# EAGLE design PowerBoard (EAGLE 9.2.2)
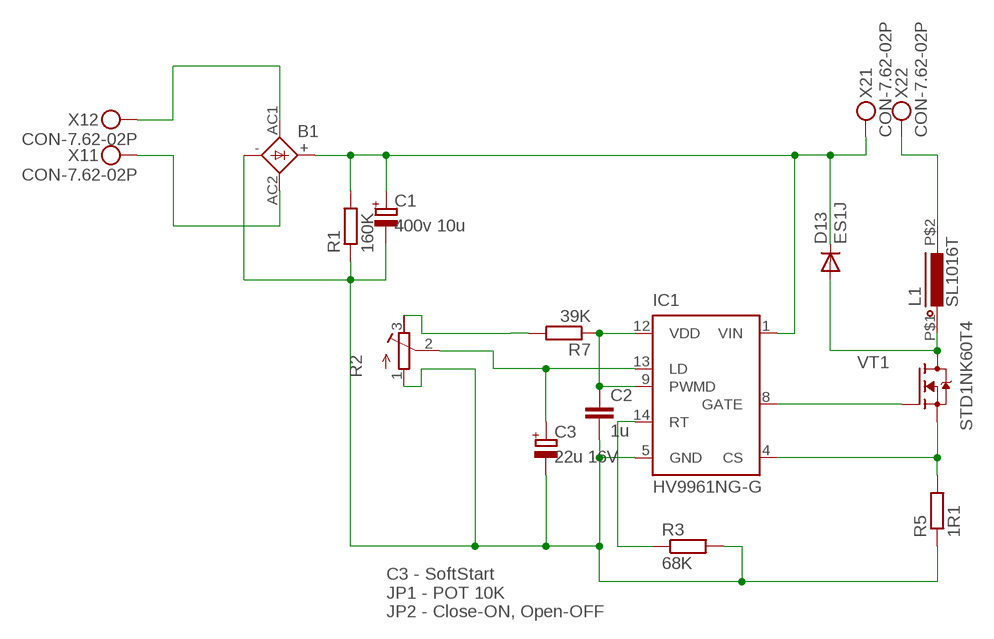
[diagram p0: schematic, sheet 1]

## Parts
B1  BRIDGEDBS  [DBS]
C1  400v 10u  CAP-POL_E3.5-8  [E3,5-8]
C2  1u  CAP_0805  [CAP0805]
C3  22u 16V  CAP-POL_3528  [CT3528]
D13  ES1J  DIODE_ES1J  [DO214AC]
IC1  HV9961NG-G  HV9910BNG  [SOIC-16NG]
L1  SL1016T  INDUCTORSL1016  [SL1016]
R1  160K  R_MF-0125  [MF-0125]
R2  R_POT3296X  [POT-3296X]
R3  68K  R_R0805  [RESC2012X50]
R5  1R1  R_MF-05  [MF-05]
R7  39K  R_R0805  [RESC2012X50]
VT1  STD1NK60T4  FET-NDPAK  [DPAK]
X1  CON-7.62-02P  [KF25C-7.62-02P-13]
X2  CON-7.62-02P  [KF25C-7.62-02P-13]

## Nets
N$2: R2.3(E) R7.2
N$3: C2.1 IC1.9(PWMD) IC1.12(VDD) R7.1
N$12: B1.AC1 X1.P$2
N$13: B1.AC2 X1.P$1
N$14: B1.- C1.- C2.2 C3.- IC1.5(GND) R1.1 R2.1(A) R3.2 R5.1
N$15: C3.+ IC1.13(LD) R2.2(S)
N$17: B1.+ C1.+ D13.C IC1.1(VIN) R1.2 X2.P$1
N$19: IC1.4(CS) R5.2 VT1.S
N$20: IC1.14(RT) R3.1
N$21: IC1.8(GATE) VT1.G
N$22: L1.P$2 X2.P$2
N$23: D13.A L1.P$1 VT1.D

## Notes on the sheet
- C3 - SoftStart
  JP1 - POT 10K
  JP2 - Close-ON, Open-OFF

## Library data of the parts
B1 = Flamberm:BRIDGE: GENERAL INSTRUMENT RECTIFIER
C1 C3 = Namenlos:CAP-POL_
C2 = Flamberm:CAP_
D13 = Flamberm:DIODE_
IC1 = Flamberm:HV9910B: Universal High Brightness LED Driver Source: www.supertex.com .. led_driver_ics_SG.pdf; OC_FARNELL: unknown; OC_NEWARK: unknown
L1 = Namenlos:INDUCTOR
R1 R3 R5 R7 = Flamberm:R_
R2 = Flamberm:R_POT
VT1 = Namenlos:FET-N
X1 X2 = Flamberm:CON-7.62-02P

## Board
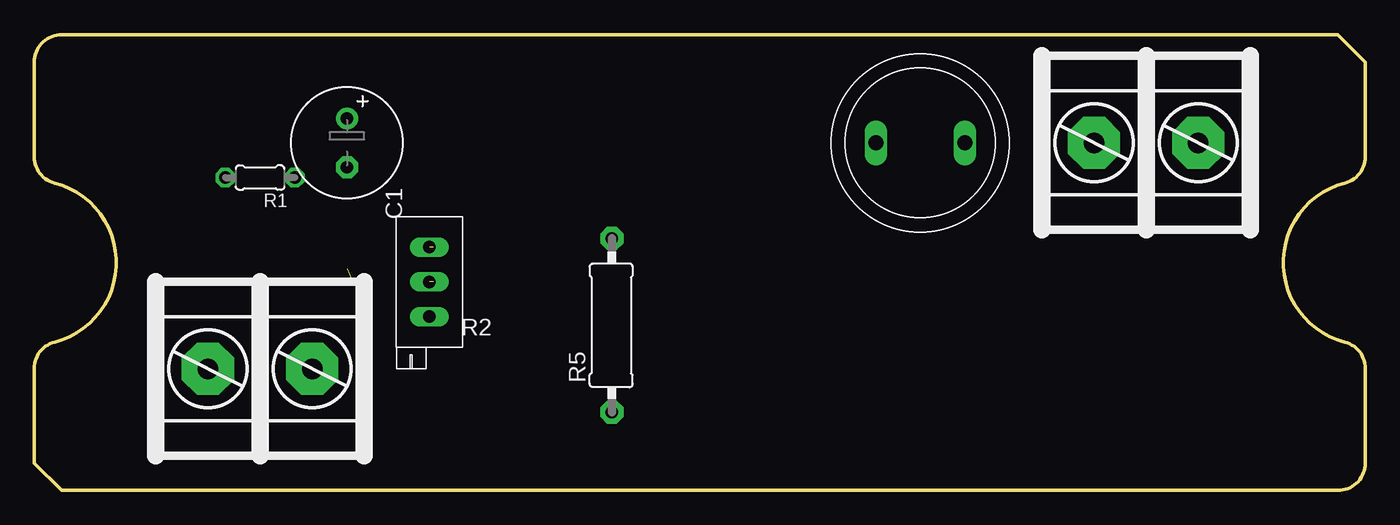
[diagram p1: board, top side]
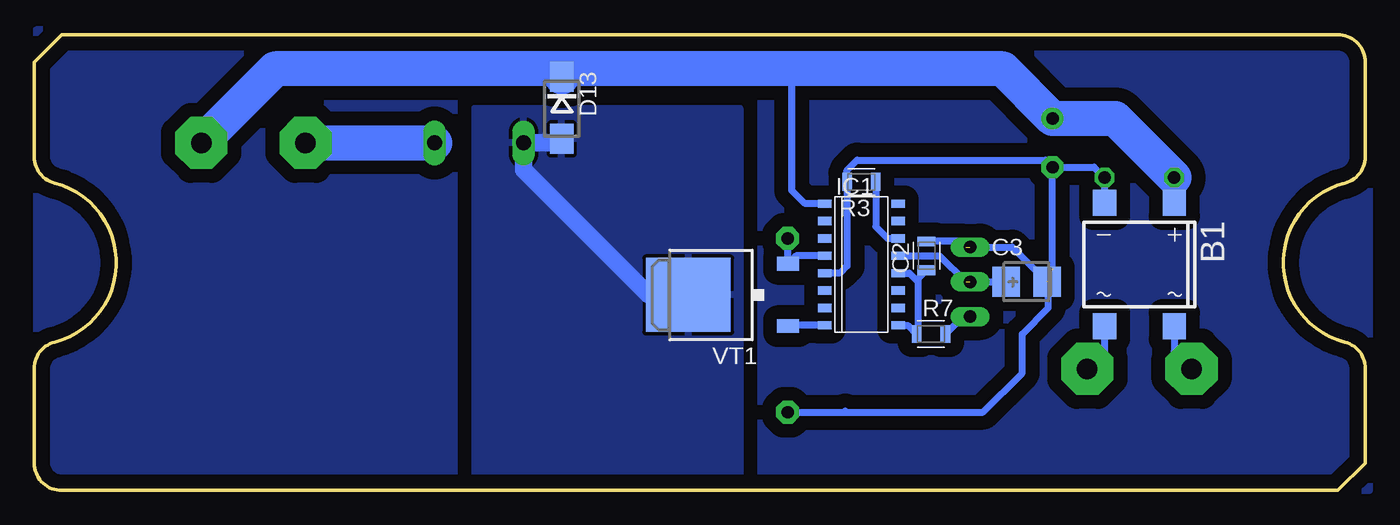
[diagram p2: board, bottom side, seen from below]

Size 97.3 x 33.3 mm. Coordinates in mm from the lower left corner, seen from the top.
Outline: 2,33.3 arc90 0,31.3 0,24.4 arc76 1.5,22.46 arc-151 1.5,10.84 arc76 0,8.9 0,2 2,0 95.3,0 arc90 97.3,2 97.3,8.9 arc76 95.8,10.84 arc-151 95.8,22.46 arc76 97.3,24.4 97.3,31.3 95.3,33.3 2,33.3
Copper layers (1*16): Top 0.035mm / dielectric 1.5mm / Bottom 0.035mm
Design rules "default": minimum track width 6mil, minimum drill 0.35mm, track to track 6mil, track to pad 6mil, pad to pad 6mil, via to via 6mil, smd to smd 6mil, copper to edge 40mil, drill to drill 6mil, minimum pad ring 10mil, minimum via ring 8mil, stop-mask expansion 4mil, vias tented up to drill 0mil, thermal gap 10mil

### Footprints (pad centres in the part's own frame; a part is rotated, then mirrored left to right if it is on the bottom)
DBS = smd 1.7 x 1.9: + -2.55,-4.5; - 2.55,-4.5; AC1 -2.55,4.5; AC2 2.55,4.5
E3,5-8 = drill 0.9 pad 1.6: + -1.778,0 | drill 0.9 pad 1.6 octagon: - 1.778,0
CAP0805 = smd 0.712 x 1.312: 1 -1.05,0; 2 1.05,0
CT3528 = smd 2 x 2.2: + -1.5,0; - 1.5,0
DO214AC = smd 2.2 x 1.7: A 2.25,0; C -2.285,0
SOIC-16NG = smd 0.6 x 1: 1 -4.445,-2.675; 2 -3.175,-2.675; 3 -1.905,-2.675; 4 -0.635,-2.675; 5 0.635,-2.675; 6 1.905,-2.675; 7 3.175,-2.675; 8 4.445,-2.675; 9 4.445,2.675; 10 3.175,2.675; 11 1.905,2.675; 12 0.635,2.675; 13 -0.635,2.675; 14 -1.905,2.675; 15 -3.175,2.675; 16 -4.445,2.675
SL1016 = drill 1.1 long: P$1 3.25,0; P$2 -3.25,0
MF-0125 = drill 0.9 octagon: 1 -2.54,0; 2 2.54,0
POT-3296X = drill 0.9 long: 1 0,-2.54; 2 0,0; 3 0,2.54
RESC2012X50 = smd 0.712 x 1.312: 1 -1.05,0; 2 1.05,0
MF-05 = drill 0.9 pad 1.676 octagon: 1 -6.35,0; 2 6.35,0
DPAK = smd 5.4 x 6.2: D 0,2.5 | smd 1 x 1.6: G -2.28,-4.8; S 2.28,-4.8
KF25C-7.62-02P-13 = drill 1.5 pad 3.81 octagon: P$1 -3.81,0; P$2 3.81,0

### Placement (x,y rotation side)
B1  16.51,16.51 180 bottom
C1  22.86,25.4 270 top
C2  32.07,17.14 90 bottom
C3  24.77,15.24 0 bottom
D13  58.74,27.94 270 bottom
IC1  36.83,16.51 270 bottom
L1  64.77,25.4 180 top
R1  16.51,22.86 180 top
R2  28.89,15.24 180 top
R3  36.83,22.54 180 bottom
R5  42.23,12.06 90 top
R7  31.75,11.43 0 bottom
VT1  46.99,14.29 90 bottom
X1  16.51,8.89 180 top
X2  81.28,25.4 180 top

### Tracks (layer width: path | path; a pad name or v marks a point on that pad's centre or on a via)
GND
  pour Bottom (isolate 1.016, rank 6): -0.32,33.66 97.16,33.66 97.16,0 -0.32,0
N$2
  Bottom 0.508: R2.3 29.43,12.7 R7.2
N$3
  Bottom 0.508: IC1.9 33.44,12.06 R7.1 32.7,11.53 32.7,15.24 | IC1.12 33.34,15.88 32.7,15.24 | C2.1 32.7,15.46 32.7,15.24
N$12
  Bottom 0.508: B1.AC1 13.96,10.15 X1.P$2
N$13
  Bottom 0.508: B1.AC2 19.06,10.15 X1.P$1
N$14  (2 unrouted)
  Bottom 0.508: R5.1 38.1,5.71 | 38.1,5.71 27.94,5.71 25.08,8.57 25.08,11.43 23.18,13.34 23.18,15.15 C3.- 25.8,17.78 29.21,17.78 | 22.86,16.19 C1.- | R1.1 | R1.1 B1.- | C1.- 19.83,23.62 R1.1 | 38.01,5.8 38.1,5.71 | R2.1 29.31,18.2 C2.2 | IC1.5 38.42,15.88 37.88,16.41 R3.2 37.88,23.4 37.15,24.13 23.37,24.13 C1.-
N$15  (1 unrouted)
  Bottom 0.508: C3.+ 29.21,15.24 31.11,17.14 IC1.13
N$17
  Bottom 0.508: R1.2 B1.+ | IC1.1 40.96,20.95 41.91,21.91 41.91,30.8
  Bottom 2.54: R1.2 18.29,27.18 C1.+ 26.48,30.8 41.91,30.8 58.74,30.8 | X2.P$1 79.69,30.8 58.74,30.8 | D13.C 58.74,30.8
N$19
  Bottom 0.406: 42.23,16.61 VT1.S
  Bottom 0.508: IC1.4 41.61,17.14 VT1.S | R5.2 42.23,16.61
N$20
  Bottom 0.508: R3.1 35.78,19.27 34.92,18.41 IC1.14
N$21
  Bottom 0.508: IC1.8 42.13,12.06 VT1.G
N$22
  Bottom 2.54: X2.P$2 L1.P$2
N$23
  Bottom 1.27: D13.A 59.03,25.4 L1.P$1 61.52,23.42 52.39,14.29 VT1.D
  pour Bottom (isolate 1.016): 45.72,27.94 45.72,0.64 45.4,0.32 65.09,0.32 65.09,27.94